# Altium schematic sheet Drive.SchDoc
size A3
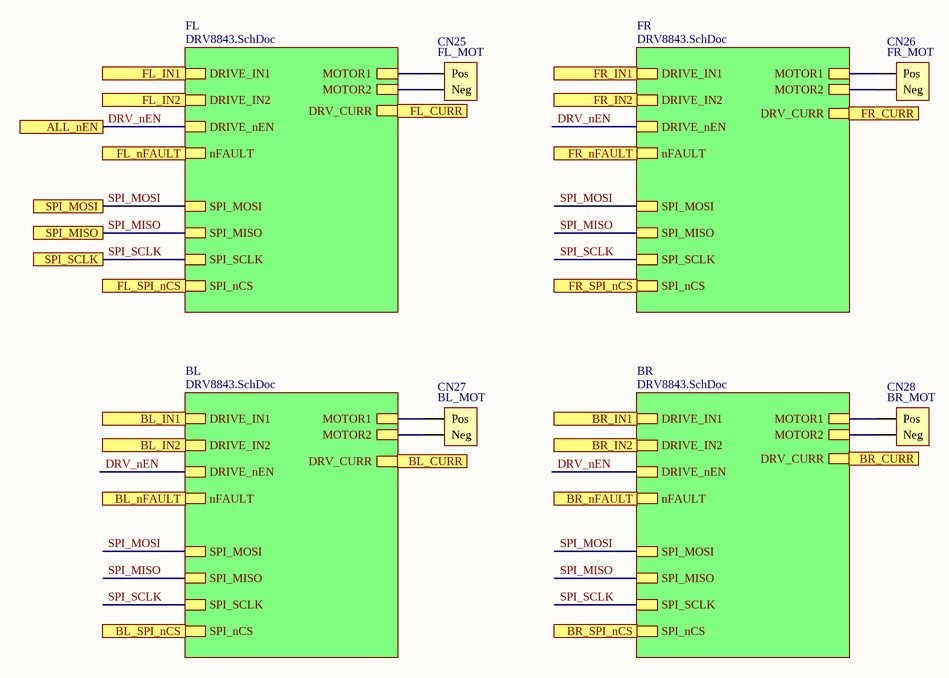
[diagram p0: Drive.SchDoc]

## Parts
CN25  FL_MOT  [Power_Leads]
CN26  FR_MOT  [Power_Leads]
CN27  BL_MOT  [Power_Leads]
CN28  BR_MOT  [Power_Leads]

## Sub-sheets
BL = DRV8843.SchDoc: DRIVE_IN1, DRIVE_IN2, DRIVE_nEN, SPI_MISO, SPI_MOSI, SPI_SCLK, SPI_nCS, nFAULT, MOTOR1, MOTOR2, DRV_CURR
BR = DRV8843.SchDoc: DRIVE_IN1, DRIVE_IN2, DRIVE_nEN, SPI_MISO, SPI_MOSI, SPI_SCLK, SPI_nCS, nFAULT, MOTOR1, MOTOR2, DRV_CURR
FL = DRV8843.SchDoc: DRIVE_IN1, DRIVE_IN2, DRIVE_nEN, SPI_MISO, SPI_MOSI, SPI_SCLK, SPI_nCS, nFAULT, MOTOR1, MOTOR2, DRV_CURR
FR = DRV8843.SchDoc: DRIVE_IN1, DRIVE_IN2, DRIVE_nEN, SPI_MISO, SPI_MOSI, SPI_SCLK, SPI_nCS, nFAULT, MOTOR1, MOTOR2, DRV_CURR

## Ports
ALL_nEN, BL_CURR, BL_IN1, BL_IN2, BL_nFAULT, BL_SPI_nCS, BR_CURR, BR_IN1, BR_IN2, BR_nFAULT, BR_SPI_nCS, FL_CURR, FL_IN1, FL_IN2, FL_nFAULT, FL_SPI_nCS, FR_CURR, FR_IN1, FR_IN2, FR_nFAULT, FR_SPI_nCS, SPI_MISO, SPI_MOSI, SPI_SCLK

## Nets
BL_CURR: port BL_CURR, sheet BL/DRV_CURR
BL_IN1: port BL_IN1, sheet BL/DRIVE_IN1
BL_IN2: port BL_IN2, sheet BL/DRIVE_IN2
BL_nFAULT: port BL_nFAULT, sheet BL/nFAULT
BL_SPI_nCS: port BL_SPI_nCS, sheet BL/SPI_nCS
BR_CURR: port BR_CURR, sheet BR/DRV_CURR
BR_IN1: port BR_IN1, sheet BR/DRIVE_IN1
BR_IN2: port BR_IN2, sheet BR/DRIVE_IN2
BR_nFAULT: port BR_nFAULT, sheet BR/nFAULT
BR_SPI_nCS: port BR_SPI_nCS, sheet BR/SPI_nCS
DRV_nEN: port ALL_nEN, sheet FL/DRIVE_nEN, sheet BL/DRIVE_nEN, sheet FR/DRIVE_nEN, sheet BR/DRIVE_nEN
FL_CURR: port FL_CURR, sheet FL/DRV_CURR
FL_IN1: port FL_IN1, sheet FL/DRIVE_IN1
FL_IN2: port FL_IN2, sheet FL/DRIVE_IN2
FL_nFAULT: port FL_nFAULT, sheet FL/nFAULT
FL_SPI_nCS: port FL_SPI_nCS, sheet FL/SPI_nCS
FR_CURR: port FR_CURR, sheet FR/DRV_CURR
FR_IN1: port FR_IN1, sheet FR/DRIVE_IN1
FR_IN2: port FR_IN2, sheet FR/DRIVE_IN2
FR_nFAULT: port FR_nFAULT, sheet FR/nFAULT
FR_SPI_nCS: port FR_SPI_nCS, sheet FR/SPI_nCS
SPI_MISO: port SPI_MISO, sheet FL/SPI_MISO, sheet BL/SPI_MISO, sheet FR/SPI_MISO, sheet BR/SPI_MISO
SPI_MOSI: port SPI_MOSI, sheet FL/SPI_MOSI, sheet BL/SPI_MOSI, sheet FR/SPI_MOSI, sheet BR/SPI_MOSI
SPI_SCLK: port SPI_SCLK, sheet FL/SPI_SCLK, sheet BL/SPI_SCLK, sheet FR/SPI_SCLK, sheet BR/SPI_SCLK
NetCN25_A: CN25.A(Pos) ; sheet FL/MOTOR1
NetCN25_K: CN25.K(Neg) ; sheet FL/MOTOR2
NetCN26_A: CN26.A(Pos) ; sheet FR/MOTOR1
NetCN26_K: CN26.K(Neg) ; sheet FR/MOTOR2
NetCN27_A: CN27.A(Pos) ; sheet BL/MOTOR1
NetCN27_K: CN27.K(Neg) ; sheet BL/MOTOR2
NetCN28_A: CN28.A(Pos) ; sheet BR/MOTOR1
NetCN28_K: CN28.K(Neg) ; sheet BR/MOTOR2

## Library data of the parts
CN25-CN28 = JST_Leads_In